# Altium schematic sheet Gyro_Mode.SchDoc
size A3
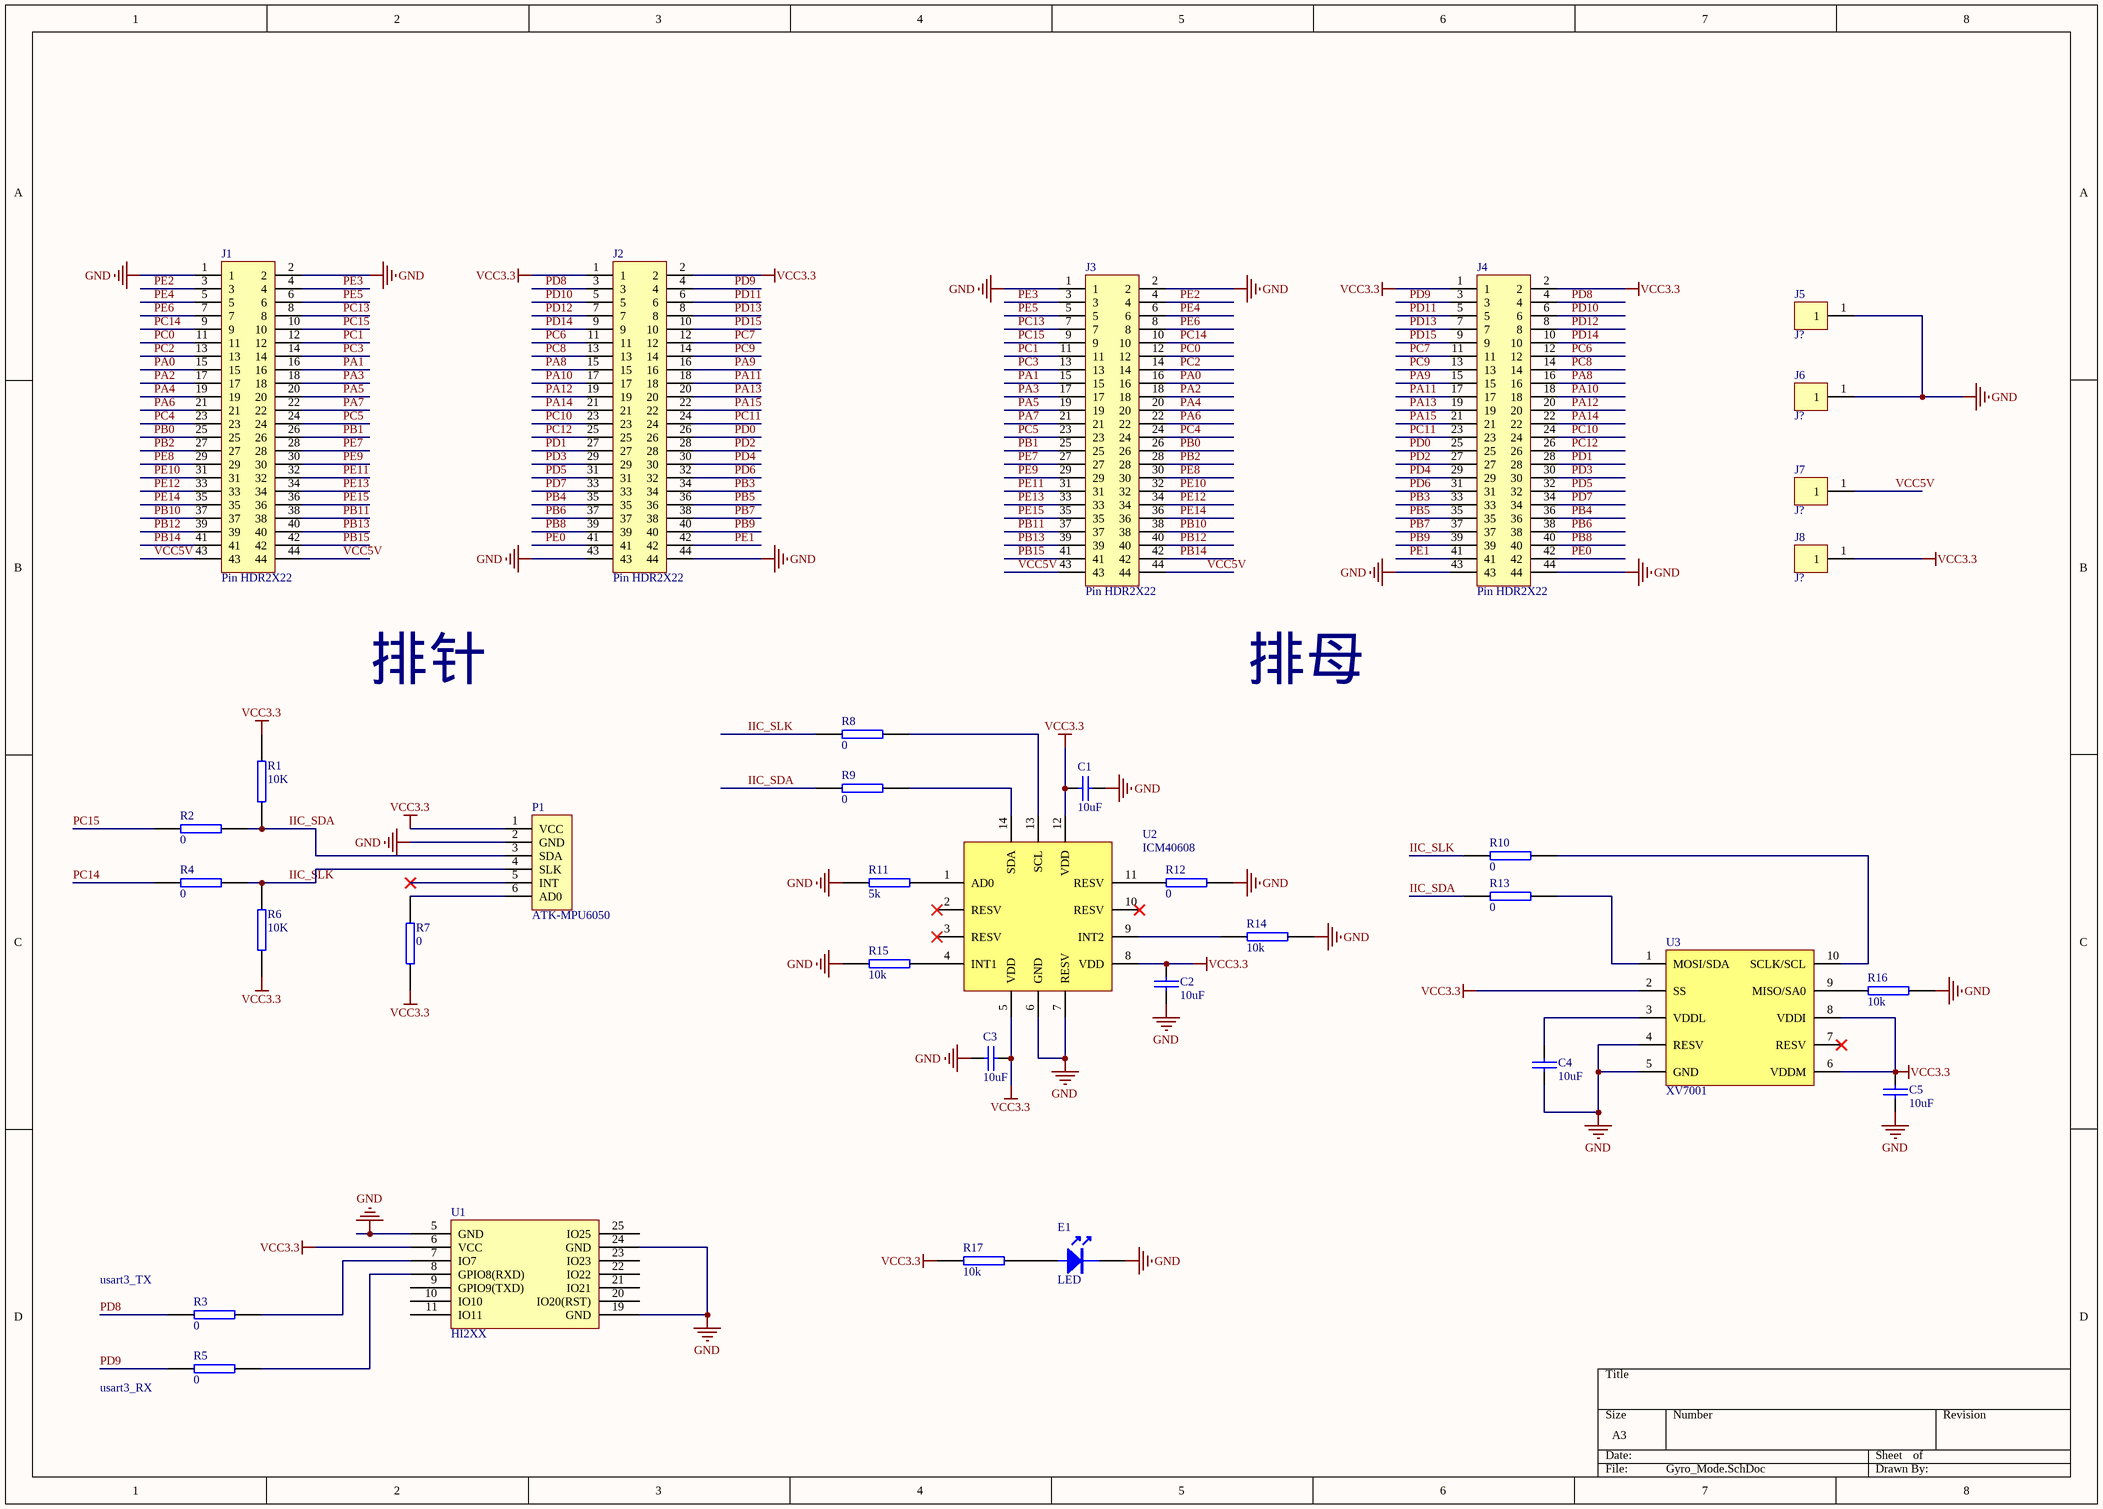
[diagram p0: Gyro_Mode.SchDoc]

## Parts
C1  10uF  [0603]
C2  10uF  [0603]
C3  10uF  [0603]
C4  10uF  [0603]
C5  10uF  [0603]
E1  LED  [LED_0603L]
J1  Pin HDR2X22  [PIN HDR2X22/2.54SMD]
J2  Pin HDR2X22  [PIN HDR2X22/2.54SMD]
J3  Pin HDR2X22  [PIN HDR2X22/2.54SMD]
J4  Pin HDR2X22  [PIN HDR2X22/2.54SMD]
J5  J?  [固定柱]
J6  J?  [固定柱]
J7  J?  [固定柱]
J8  J?  [固定柱]
P1  ATK-MPU6050  [ATK-MPU6080]
R1  10K  [0603]
R2  0  [0603]
R3  0  [0603]
R4  0  [0603]
R5  0  [0603]
R6  10K  [0603]
R7  0  [0603]
R8  0  [0603]
R9  0  [0603]
R10  0  [0603]
R11  5k  [0603]
R12  0  [0603]
R13  0  [0603]
R14  10k  [0603]
R15  10k  [0603]
R16  10k  [0603]
R17  10k  [0603]
U1  HI2XX  [HI2XX_PLCC28]
U2  ICM40608  [ICM40608-LGA-14]
U3  XV7001  [XV7001]

## Nets
GND: C1.1 C2.1 C3.1 C4.1 C5.1 E1.2 J1.1 J1.2 J2.43 J2.44 J3.1 J3.2 J4.43 J4.44 J5.1 J6.1 P1.2(GND) R11.1 R12.2 R14.2 R15.1 R16.2 U1.5(GND) U1.19(GND) U1.24(GND) U2.6(GND) U2.7(RESV) U3.4(RESV) U3.5(GND)
VCC3.3: C1.2 C2.2 C3.2 C5.2 J2.1 J2.2 J4.1 J4.2 J8.1 P1.1(VCC) R1.2 R6.1 R7.1 R17.1 U1.6(VCC) U2.5(VDD) U2.8(VDD) U2.12(VDD) U3.2(SS) U3.6(VDDM) U3.8(VDDI)
IIC_SDA: P1.3(SDA) R1.1 R2.2 R9.1 R13.1
IIC_SLK: P1.4(SLK) R4.2 R6.2 R8.1 R10.1
PA0: J1.15 J3.16
PA1: J1.16 J3.15
PA2: J1.17 J3.18
PA3: J1.18 J3.17
PA4: J1.19 J3.20
PA5: J1.20 J3.19
PA6: J1.21 J3.22
PA7: J1.22 J3.21
PA8: J2.15 J4.16
PA9: J2.16 J4.15
PA10: J2.17 J4.18
PA11: J2.18 J4.17
PA12: J2.19 J4.20
PA13: J2.20 J4.19
PA14: J2.21 J4.22
PA15: J2.22 J4.21
PB0: J1.25 J3.26
PB1: J1.26 J3.25
PB2: J1.27 J3.28
PB3: J2.34 J4.33
PB4: J2.35 J4.36
PB5: J2.36 J4.35
PB6: J2.37 J4.38
PB7: J2.38 J4.37
PB8: J2.39 J4.40
PB9: J2.40 J4.39
PB10: J1.37 J3.38
PB11: J1.38 J3.37
PB12: J1.39 J3.40
PB13: J1.40 J3.39
PB14: J1.41 J3.42
PB15: J1.42 J3.41
PC0: J1.11 J3.12
PC1: J1.12 J3.11
PC2: J1.13 J3.14
PC3: J1.14 J3.13
PC4: J1.23 J3.24
PC5: J1.24 J3.23
PC6: J2.11 J4.12
PC7: J2.12 J4.11
PC8: J2.13 J4.14
PC9: J2.14 J4.13
PC10: J2.23 J4.24
PC11: J2.24 J4.23
PC12: J2.25 J4.26
PC13: J1.8 J3.7
PC14: J1.9 J3.10 R4.1
PC15: J1.10 J3.9 R2.1
PD0: J2.26 J4.25
PD1: J2.27 J4.28
PD2: J2.28 J4.27
PD3: J2.29 J4.30
PD4: J2.30 J4.29
PD5: J2.31 J4.32
PD6: J2.32 J4.31
PD7: J2.33 J4.34
PD8: J2.3 J4.4 R3.1
PD9: J2.4 J4.3 R5.1
PD10: J2.5 J4.6
PD11: J2.6 J4.5
PD12: J2.7 J4.8
PD13: J2.8 J4.7
PD14: J2.9 J4.10
PD15: J2.10 J4.9
PE0: J2.41 J4.42
PE1: J2.42 J4.41
PE2: J1.3 J3.4
PE3: J1.4 J3.3
PE4: J1.5 J3.6
PE5: J1.6 J3.5
PE6: J1.7 J3.8
PE7: J1.28 J3.27
PE8: J1.29 J3.30
PE9: J1.30 J3.29
PE10: J1.31 J3.32
PE11: J1.32 J3.31
PE12: J1.33 J3.34
PE13: J1.34 J3.33
PE14: J1.35 J3.36
PE15: J1.36 J3.35
VCC5V: J1.43 J1.44 J3.43 J3.44 J7.1
NetC4_2: C4.2 U3.3(VDDL)
NetE1_1: E1.1 R17.2
NetP1_6: P1.6(AD0) R7.2
NetR3_2: R3.2 U1.7(IO7)
NetR5_2: R5.2 U1.8(GPIO8(RXD))
NetR8_2: R8.2 U2.13(SCL)
NetR9_2: R9.2 U2.14(SDA)
NetR10_2: R10.2 U3.10(SCLK/SCL)
NetR11_2: R11.2 U2.1(AD0)
NetR12_1: R12.1 U2.11(RESV)
NetR13_2: R13.2 U3.1(MOSI/SDA)
NetR14_1: R14.1 U2.9(INT2)
NetR15_2: R15.2 U2.4(INT1)
NetR16_1: R16.1 U3.9(MISO/SA0)

Not connected (* = marked no-connect by the designer): P1 5(INT)*; U1 9(GPIO9(TXD)) 10(IO10) 11(IO11) 20(IO20(RST)) 21(IO21) 22(IO22) 23(IO23) 25(IO25); U2 2(RESV)* 3(RESV)* 10(RESV)*; U3 7(RESV)*

## Notes on the sheet
- 排针
- 排母
- (near R3) usart3_TX
- (near R5) usart3_RX

## Library data of the parts
C1-C5 = CAP Nonpolarity: 无极电容
E1 = LED: LED灯
J1-J4 = Pin HDR2X22: 22pin双排2.54接口
J5-J8 = 固定柱
R1-R17 = R: 电阻
U1 = HI2XX: HI226
U3 = XV7001: 爱普生陀螺仪
P1 = ATK-MPU6050: LatestRevisionDate: 17-Jul-2002; LatestRevisionNote: Re-released for DXP Platform.; Publisher: Altium Limited